# EAGLE design SparkFun_Clock_Generator_5PV49V60 (EAGLE 9.5.1)
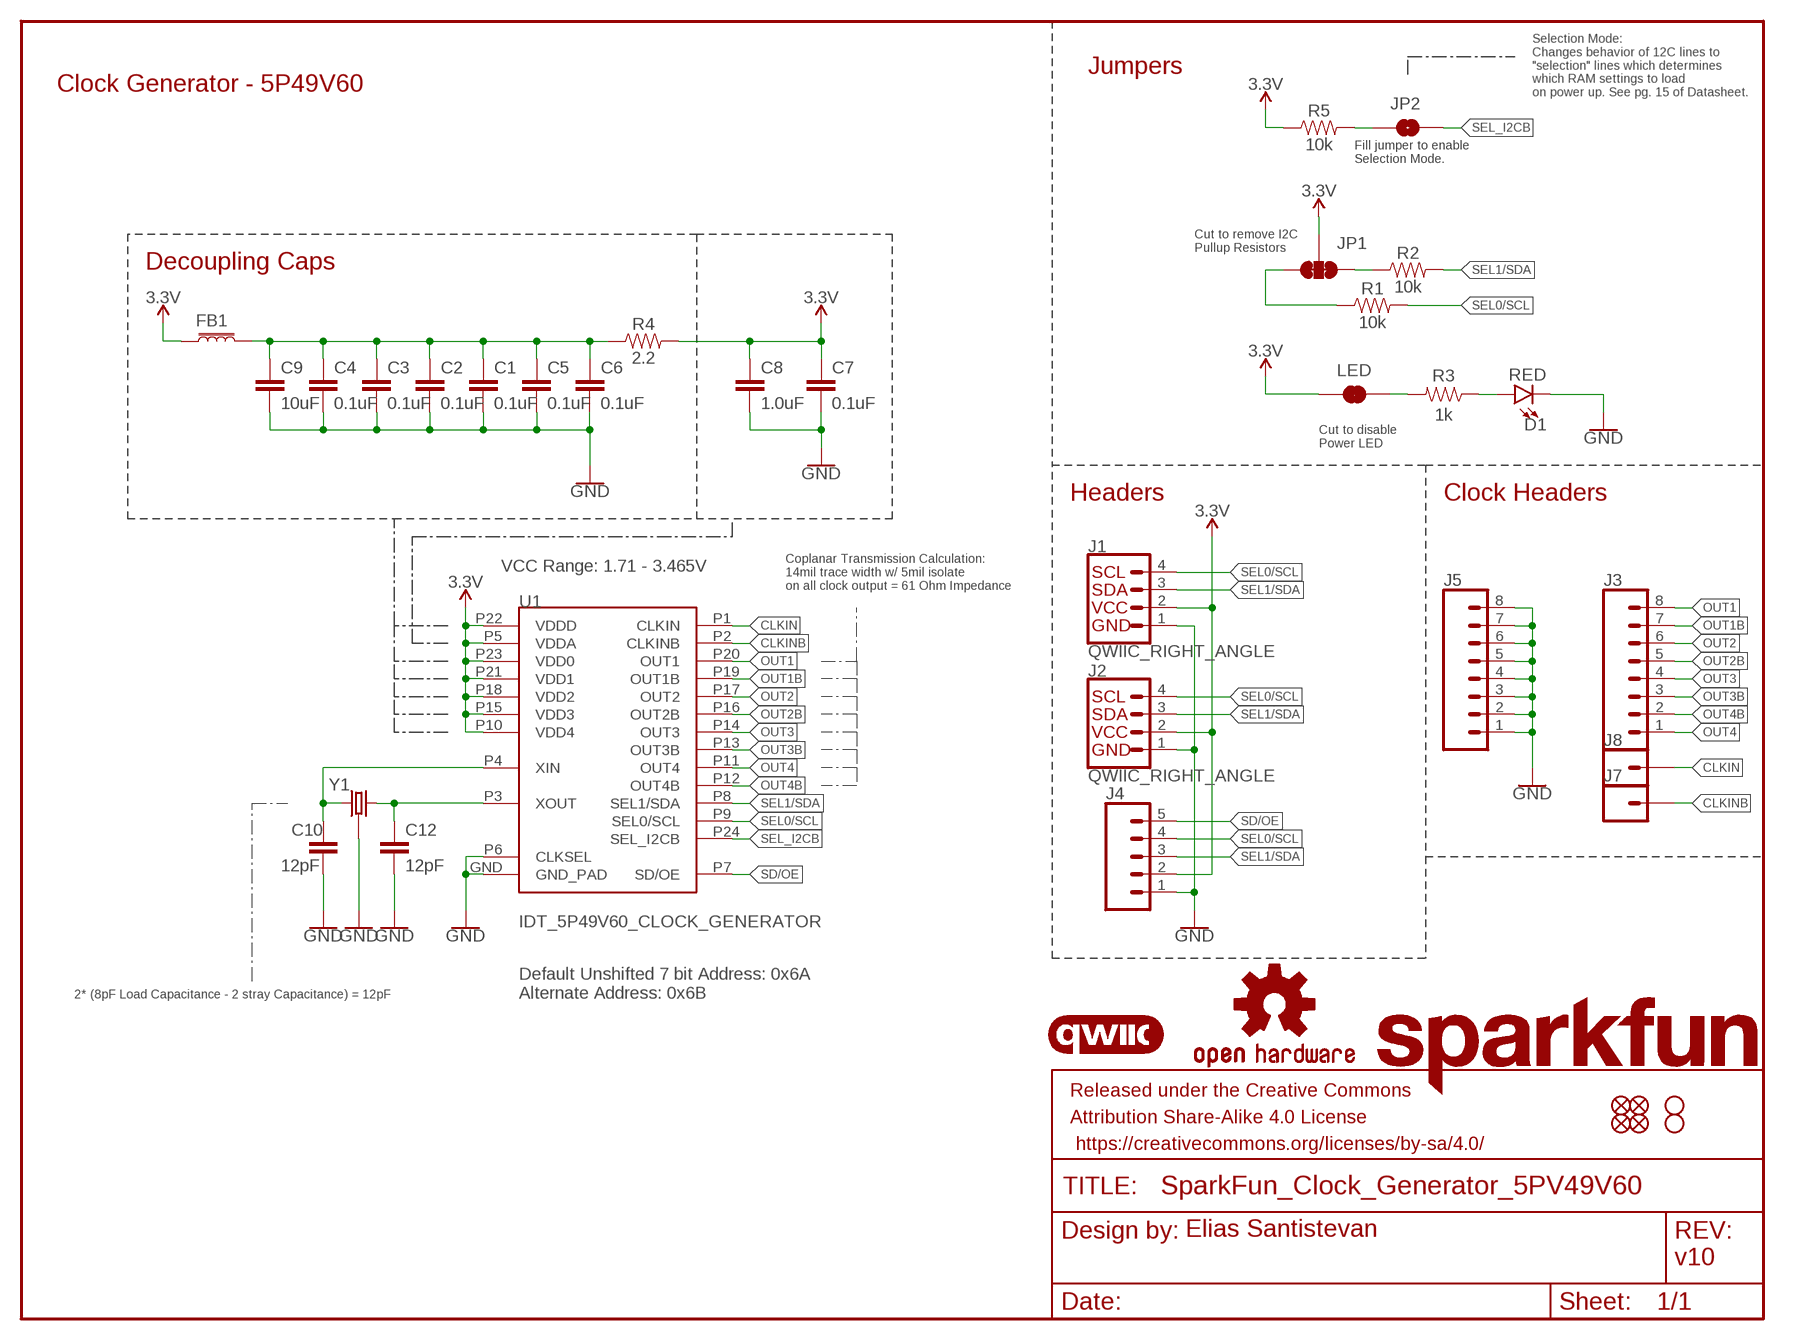
[diagram p0: schematic, sheet 1]

## Parts
C1  0.1uF  0.1UF-0402-16V-10%  [0402]
C2  0.1uF  0.1UF-0402-16V-10%  [0402]
C3  0.1uF  0.1UF-0402-16V-10%  [0402]
C4  0.1uF  0.1UF-0402-16V-10%  [0402]
C5  0.1uF  0.1UF-0402-16V-10%  [0402]
C6  0.1uF  0.1UF-0402-16V-10%  [0402]
C7  0.1uF  0.1UF-0402-16V-10%  [0402]
C8  1.0uF  1.0UF-0402-16V-10%  [0402]
C9  10uF  10UF-0603-6.3V-20%  [0603]
C10  12pF  12PF-0402-50V-5%  [0402]
C12  12pF  12PF-0402-50V-5%  [0402]
D1  RED  LED-RED0603  [LED-0603]
FB1  FERRITE_BEAD-120_OHM-0402  [0402]
FD1  FIDUCIALUFIDUCIAL  [FIDUCIAL-MICRO]
FD2  FIDUCIALUFIDUCIAL  [FIDUCIAL-MICRO]
FD3  FIDUCIALUFIDUCIAL  [FIDUCIAL-MICRO]
FD4  FIDUCIALUFIDUCIAL  [FIDUCIAL-MICRO]
FRAME1  FRAME-LETTER  [CREATIVE_COMMONS]
H1  STAND-OFFTIGHT  [STAND-OFF-TIGHT]
H2  STAND-OFFTIGHT  [STAND-OFF-TIGHT]
J1  QWIIC_RIGHT_ANGLE  QWIIC_CONNECTORJS-1MM  [JST04_1MM_RA]
J2  QWIIC_RIGHT_ANGLE  QWIIC_CONNECTORJS-1MM  [JST04_1MM_RA]
J3  CONN_08NO_SILK_FEMALE_PTH  [1X08_NO_SILK]
J4  CONN_05NO_SILK  [1X05_NO_SILK]
J5  CONN_08NO_SILK_FEMALE_PTH  [1X08_NO_SILK]
J7  CONN_01PTH_NO_SILK_SMALL  [1X01_SMALL]
J8  CONN_01PTH_NO_SILK_SMALL  [1X01_SMALL]
JP1  JUMPER-SMT_3_2-NC_TRACE_SILK  [SMT-JUMPER_3_2-NC_TRACE_SILK]
JP2  JUMPER-SMT_2_NO_SILK  [SMT-JUMPER_2_NO_SILK]
LED  JUMPER-SMT_2_NC_TRACE_SILK  [SMT-JUMPER_2_NC_TRACE_SILK]
LOGO1  SFE_LOGO_NAME.1_INCH  [SFE_LOGO_NAME_.1]
LOGO2  OSHW-LOGOS  [OSHW-LOGO-S]
LOGO3  QWIIC_LOGO_4MM  [QWIIC_4MM]
R1  10k  10KOHM-0402-1/16W-1%  [0402]
R2  10k  10KOHM-0402-1/16W-1%  [0402]
R3  1KOHM-0402-1/16W-1%  [0402]
R4  2.2  2.2OHM-0603-1/10W-5%  [0603]
R5  10k  10KOHM-0402-1/16W-1%  [0402]
U1  IDT_5P49V60_CLOCK_GENERATOR  [VFQFPN-24]
Y1  16MHz  CRYSTAL-16MHZ_SMALL  [CRYSTAL-SMD-2X2.5MM]

## Nets
3.3V: C1.1 C2.1 C3.1 C4.1 C5.1 C6.1 C7.1 C8.1 C9.1 FB1.1 FB1.2 J1.2 J2.2 J4.2 JP1.2 LED.2 R4.1 R4.2 R5.1 U1.P5(VDDA) U1.P10(VDD4) U1.P15(VDD3) U1.P18(VDD2) U1.P21(VDD1) U1.P22(VDDD) U1.P23(VDD0)
CLKIN: J8.P$1 U1.P1(CLKIN)
CLKINB: J7.P$1 U1.P2(CLKINB)
GND: C1.2 C2.2 C3.2 C4.2 C5.2 C6.2 C7.2 C8.2 C9.2 C10.2 C12.2 D1.C J1.1 J2.1 J4.1 J5.1 J5.2 J5.3 J5.4 J5.5 J5.6 J5.7 J5.8 U1.GND(GND_PAD) U1.P6(CLKSEL) Y1.P2(GND) Y1.P4(GND)
N$1: JP1.1 R2.1
N$2: C12.1 U1.P3(XOUT) Y1.P1
N$3: JP1.3 R1.1
N$4: LED.1 R3.2
N$5: D1.A R3.1
N$6: C10.1 U1.P4(XIN) Y1.P3
N$7: JP2.1 R5.2
OUT1 [Clock]: J3.8 U1.P20(OUT1)
OUT1B [Clock]: J3.7 U1.P19(OUT1B)
OUT2 [Clock]: J3.6 U1.P17(OUT2)
OUT2B [Clock]: J3.5 U1.P16(OUT2B)
OUT3 [Clock]: J3.4 U1.P14(OUT3)
OUT3B [Clock]: J3.3 U1.P13(OUT3B)
OUT4 [Clock]: J3.1 U1.P11(OUT4)
OUT4B [Clock]: J3.2 U1.P12(OUT4B)
SD/OE: J4.5 U1.P7(SD/OE)
SEL0/SCL: J1.4 J2.4 J4.4 R1.2 U1.P9(SEL0/SCL)
SEL1/SDA: J1.3 J2.3 J4.3 R2.2 U1.P8(SEL1/SDA)
SEL_I2CB: JP2.2 U1.P24(SEL_I2CB)

## Notes on the sheet
- Jumpers
- Clock Generator - 5P49V60
- Selection Mode: 
  Changes behavior of 12C lines to 
  "selection" lines which determines 
  which RAM settings to load
  on power up. See pg. 15 of Datasheet.
- Fill jumper to enable
  Selection Mode.
- Cut to remove I2C
  Pullup Resistors
- Decoupling Caps
- 1k
- Cut to disable
  Power LED
- Headers | Clock Headers
- VCC Range: 1.71 - 3.465V
- Coplanar Transmission Calculation:
  14mil trace width w/ 5mil isolate 
  on all clock output = 61 Ohm Impedance
- 2* (8pF Load Capacitance - 2 stray Capacitance) = 12pF
- Default Unshifted 7 bit Address: 0x6A
  Alternate Address: 0x6B
- Elias Santistevan
- v10

## Library data of the parts
C1-C7 = SparkFun-Capacitors:0.1UF: 0.1µF ceramic capacitors A capacitor is a passive two-terminal electrical component used to store electrical energy temporarily in an electric field.; PROD_ID: CAP-12416
C8 = SparkFun-Capacitors:1.0UF: 1µF ceramic capacitors A capacitor is a passive two-terminal electrical component used to store electrical energy temporarily in an electric field.; PROD_ID: CAP-12417
C9 = SparkFun-Capacitors:10UF: 10.0µF ceramic capacitors A capacitor is a passive two-terminal electrical component used to store electrical energy temporarily in an electric field.; PROD_ID: CAP-11015
C10 C12 = SparkFun-Capacitors:12PF: 12pF ceramic capacitors A capacitor is a passive two-terminal electrical component used to store electrical energy temporarily in an electric field.; PROD_ID: CAP-14665
D1 = SparkFun-LED:LED-RED: Red SMD LED Used in manufacturing of most products at SparkFun Packages: 0603 - SMD 0603 package [Product Link] <http://docs.avagotech.com/docs/AV02-0551EN> 0603 SMART - SMD 0603 SMART package ( more efficient and expensive)[Product Link] <http://www.osram-os.com/Graphics/XPic2/00077099_0.pdf> 1206 - SMD1206 package [Product Link] <https://www.sparkfun.com/datasheets/DevTools/LilyPad/Q150OVS4.pdff> SparkFun Products: Pro Mini 328 -5V <https://www.sparkfun.com/products/821> RedBoard <https://www.sparkfun.com/products/12757> IOIO-OTG <https://www.sparkfun.com/products/13613>; PROD_ID: DIO-00819
FB1 = SparkFun-Coils:FERRITE_BEAD-120_OHM: Ferrite Bead (blocks, cores, rings, chokes, etc.) Inductor with layers of ferrite used to suppress high frequencies. Often used to isolate high frequency noise.; MFG_PART: BLM15HB121SN1D; PROD_ID: NDUC-14206
FD1-FD4 = SparkFun-Aesthetics:FIDUCIAL: Fiducial Alignment Points Point-of-reference for pick-and-place machines and other optical instruments.
FRAME1 = SparkFun-Aesthetics:FRAME-LETTER: Schematic Frame - Letter Standard 8.5x11 US Letter frame
H1 H2 = SparkFun-Hardware:STAND-OFF: Stand Off Drill holes for mechanically mounting via screws, standoffs, etc. Note: Use the keepout ring to avoid running the screw head into surrounding components. Variant Overviews STAND-OFF - Mechanical footprint for a #4 phillips button head screw. STAND-OFF-TIGHT - Mechanical footprint for a #4 phillips button head screw, Example SparkFun Products Screw - Phillips Head (1/4", 4-40, 10 pack) <https://www.sparkfun.com/products/10453> (PRT-10453) Screw - Phillips Head (1/2", 4-40, 10 pack) <https://www.sparkfun.com/products/10452> (PRT-10452) Screw - Phillips Head (3/4", 4-40, 10 pack) <https://www.sparkfun.com/products/10451> (PRT-10451) Screw - Phillips Head (1", 4-40, 10 pack) <https://www.sparkfun.com/products/10450> (PRT-10450)
J1 J2 = SparkFun-Connectors:QWIIC_CONNECTOR: SparkFun I2C Standard Qwiic Connector An SMD 1mm pitch JST connector makes it easy and quick (get it? Qwiic?) to connect I2C devices to each other. The Qwiic system <http://www.sparkfun.com/qwiic> enables fast and solderless connection between popular platforms and various sensors and actuators. We carry 200mm <https://www.sparkfun.com/products/14204>, 100mm <https://www.sparkfun.com/products/14205>, 50mm <https://www.sparkfun.com/products/14206>, and breadboard friendly <https://www.sparkfun.com/products/14207> Qwiic cables. We also offer 10 pcs strips <https://www.sparkfun.com/products/14323> the SMD connectors.; PROD_ID: CONN-13694
J3 J5 = SparkFun-Connectors:CONN_08: Multi connection point. Often used as Generic Header-pin footprint for 0.1 inch spaced/style header connections On any of the 0.1 inch spaced packages, you can populate with these: Break Away Headers - Straight <https://www.sparkfun.com/products/116> (PRT-00116) Break Away Male Headers - Right Angle <https://www.sparkfun.com/products/553> (PRT-00553) Female Headers <https://www.sparkfun.com/products/115> (PRT-00115) Break Away Headers - Machine Pin <https://www.sparkfun.com/products/117> (PRT-00117) Break Away Female Headers - Swiss Machine Pin <https://www.sparkfun.com/products/743> (PRT-00743) Arduino Stackable Header - 8 Pin <https://www.sparkfun.com/products/9279> (PRT-09279) For SCREWTERMINALS and SPRING TERMINALS visit here: Screw Terimnals on SparkFun.com <https://www.sparkfun.com/search/results?term=Screw+Terminals> (5mm/3.5mm/2.54mm spacing) This device is also useful as a general connection point to wire up your design to another part of your project. Our various solder wires solder well into these plated through hole pads. Hook-Up Wire - Assortment (Stranded, 22 AWG) <https://www.sparkfun.com/products/11375> (PRT-11375) Hook-Up Wire - Assortment (Solid Core, 22 AWG) <https://www.sparkfun.com/products/11367> (PRT-11367) View the entire wire category on our website here <https://www.sparkfun.com/categories/141> Special notes: Molex polarized connector foot print use with SKU : PRT-08231 with associated crimp pins and housings. 1MM SMD Version SKU: PRT-10208 NOTES ON THE VARIANTS LOCK and LOCK_LONGPADS... This footprint was designed to help hold the alignment of a through-hole component (i.e. 6-pin header) while soldering it into place. You may notice that each hole has been shifted either up or down by 0.005 of an inch from it's more standard position (which is a perfectly straight line). This slight alteration caused the pins (the squares in the middle) to touch the edges of the holes. Because they are alternating, it causes a "brace" to hold the component in place. 0.005 has proven to be the perfect amount of "off-center" position when using our standard breakaway headers. Although looks a little odd when you look at the bare footprint, once you have a header in there, the alteration is very hard to notice. Also,if you push a header all the way into place, it is covered up entirely on the bottom side.; PROD_ID: CONN-08438
J4 = SparkFun-Connectors:CONN_05: Multi connection point. Often used as Generic Header-pin footprint for 0.1 inch spaced/style header connections On any of the 0.1 inch spaced packages, you can populate with these: Break Away Headers - Straight <https://www.sparkfun.com/products/116> (PRT-00116) Break Away Male Headers - Right Angle <https://www.sparkfun.com/products/553> (PRT-00553) Female Headers <https://www.sparkfun.com/products/115> (PRT-00115) Break Away Headers - Machine Pin <https://www.sparkfun.com/products/117> (PRT-00117) Break Away Female Headers - Swiss Machine Pin <https://www.sparkfun.com/products/743> (PRT-00743) For SCREWTERMINALS and SPRING TERMINALS visit here: Screw Terimnals on SparkFun.com <https://www.sparkfun.com/search/results?term=Screw+Terminals> (5mm/3.5mm/2.54mm spacing) This device is also useful as a general connection point to wire up your design to another part of your project. Our various solder wires solder well into these plated through hole pads. Hook-Up Wire - Assortment (Stranded, 22 AWG) <https://www.sparkfun.com/products/11375> (PRT-11375) Hook-Up Wire - Assortment (Solid Core, 22 AWG) <https://www.sparkfun.com/products/11367> (PRT-11367) View the entire wire category on our website here <https://www.sparkfun.com/categories/141> Special notes: Molex polarized connector foot print use with SKU : PRT-08231 with associated crimp pins and housings. 1MM SMD Version SKU: PRT-10208
J7 J8 = SparkFun-Connectors:CONN_01: Single connection point. Often used as Generic Header-pin footprint for 0.1 inch spaced/style header connections On any of the 0.1 inch spaced packages, you can populate with these: Break Away Headers - Straight <https://www.sparkfun.com/products/116> (PRT-00116) Break Away Male Headers - Right Angle <https://www.sparkfun.com/products/553> (PRT-00553) Female Headers <https://www.sparkfun.com/products/115> (PRT-00115) Break Away Headers - Machine Pin <https://www.sparkfun.com/products/117> (PRT-00117) Break Away Female Headers - Swiss Machine Pin <https://www.sparkfun.com/products/743> (PRT-00743) This device is also useful as a general connection point to wire up your design to another part of your project. Our various solder wires solder well into these plated through hole pads. Hook-Up Wire - Assortment (Stranded, 22 AWG) <https://www.sparkfun.com/products/11375> (PRT-11375) Hook-Up Wire - Assortment (Solid Core, 22 AWG) <https://www.sparkfun.com/products/11367> (PRT-11367) View the entire wire category on our website here <https://www.sparkfun.com/categories/141> Special notes: SMTSO-256-ET is a "flush mount" nut for a 4-40 screw. We mostly use this on specialty testbeds; it is a nice way to connect hardware to your PCB at an adjustable hieght. Also note, the SNAP packages are for using a snappable style connector. We sell a baggie of snaps and they are also used on two LilyPad designs: Snap Assortment - 30 pack (male and female) <https://www.sparkfun.com/products/11347> (DEV-11347) LilyPad Arduino SimpleSnap <https://www.sparkfun.com/products/10941> (DEV-10941) LilyPad SimpleSnap Protoboard <https://www.sparkfun.com/products/10940> (DEV-10940)
JP1 = SparkFun-Jumpers:JUMPER-SMT_3_2-NC_TRACE: Normally closed trace jumper (2 of 2 connections) This jumper has a trace between all three pads so they are normally closed (NC). Use a razor knife to open the connection(s). For best results follow the IPC guidelines for cutting traces: Cutout at least 0.063 mm (0.005 in). Remove all loose material to clean up the cut area. Seal the cut with an approved epoxy. Reapply solder to reclose the connection(s).
JP2 = SparkFun-Jumpers:JUMPER-SMT_2_NO: Normally open jumper This jumper has two pads in close proximity to each other. Apply solder to close the connection. Round pads are easier to solder for beginners, but are a lot larger. SparkFun Product that uses the round pads: SparkFun EL Sequencer <https://www.sparkfun.com/products/12781>
LED = SparkFun-Jumpers:JUMPER-SMT_2_NC_TRACE: Normally closed trace jumper This jumper has a trace between two pads so it's normally closed (NC). Use a razor knife to open the connection. For best results follow the IPC guidelines for cutting traces: Cutout at least 0.063 mm (0.005 in). Remove all loose material to clean up the cut area. Seal the cut with an approved epoxy. Reapply solder to reclose the connection.
LOGO1 = SparkFun-Aesthetics:SFE_LOGO_NAME: SparkFun Font Logo This is the SparkFun name logo. The logo on the schematic will always be the same size; the package variant is the height of the flame part of the logo (or the height the flame would be, if it were drawn). Default layer for the logo on the board is tSilk.
LOGO2 = SparkFun-Aesthetics:OSHW-LOGO: Open-Source Hardware (OSHW) Logo This logo indicates the piece of hardware it is found on incorporates a OSHW license and/or adheres to the definition of open source hardware found here: http://freedomdefined.org/OSHW
LOGO3 = SparkFun-Aesthetics:QWIIC_LOGO: Qwiic Logos for placement on schematic and PCB. The 5.5mm silk logo is best for placing next to Qwiic connector.
R1 R2 R5 = SparkFun-Resistors:10KOHM: 10kΩ resistor A resistor is a passive two-terminal electrical component that implements electrical resistance as a circuit element. Resistors act to reduce current flow, and, at the same time, act to lower voltage levels within circuits. - Wikipedia; PROD_ID: RES-14241
R3 = SparkFun-Resistors:1KOHM: 1kΩ resistor A resistor is a passive two-terminal electrical component that implements electrical resistance as a circuit element. Resistors act to reduce current flow, and, at the same time, act to lower voltage levels within circuits. - Wikipedia; PROD_ID: RES-14342
R4 = SparkFun-Resistors:2.2OHM: 2.2Ω resistor A resistor is a passive two-terminal electrical component that implements electrical resistance as a circuit element. Resistors act to reduce current flow, and, at the same time, act to lower voltage levels within circuits. - Wikipedia; PROD_ID: RES-07823
U1 = SparkFun-IC-Special-Function:IDT_5P49V60_CLOCK_GENERATOR: Clock Generator 5P49V60 The 5P49V60 is a programmable clock generator intended for automotive applications. Configurations may be stored in on-chip One-Time Programmable (OTP) memory or changed using I2C interface. This is IDT’s sixth generation of programmable clock technology (VersaClock 6E). The frequencies are generated from a single reference clock. The reference clock can come from one of the two redundant clock inputs. A glitchless manual switchover function allows one of the redundant clocks to be selected during normal operation. Two select pins allow up to four different configurations to be programmed and accessible using processor GPIOs or bootstrapping. The different selections may be used for different operating modes (full function, partial function, partial power-down), regional standards (US, Japan, Europe) or system production margin testing. The device may be configured to use one of two I2C addresses to allow multiple devices to be used in a system.; PROD_ID: IC-14612
Y1 = SparkFun-Clocks:CRYSTAL-16MHZ_SMALL: 16 MHz Crystal Digikey Link <https://www.digikey.com/product-detail/en/epson/FA-20H-16.0000MF10Z-AJ5/SER4201TR-ND/7430936> Crystal Attributes: Frequency: 16 MHz Frequency Stability: +/- 10ppm Frequency Tolerance: +/- 10ppm Load Capacitance: 8pF ESR: 80 Ohms Operating Mode: Fundamental PAD 2 and PAD 4 are GROUNDED; PROD_ID: XTAL-14664

## Net classes
1 Clock: clearance 0.127 mm

## Board
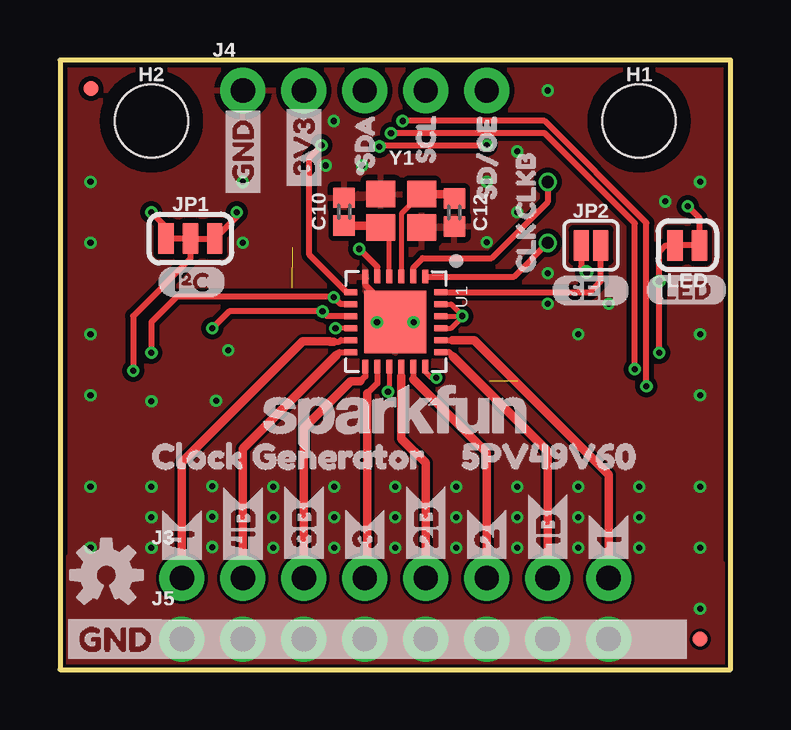
[diagram p1: board, top side]
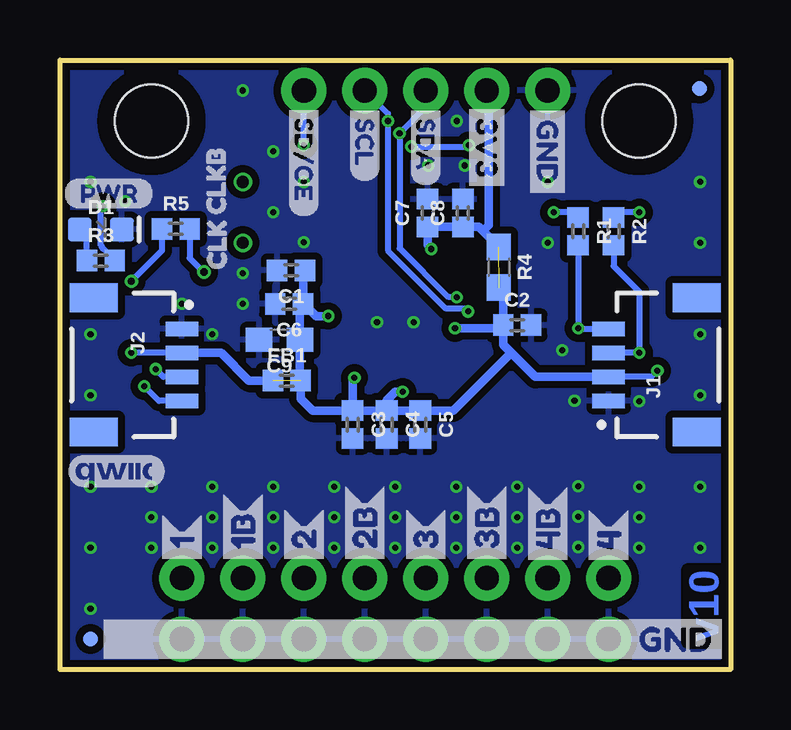
[diagram p2: board, bottom side, seen from below]

Size 27.94 x 25.4 mm. Coordinates in mm from the lower left corner, seen from the top.
Outline: 0,25.4 0,0 27.94,0 27.94,25.4 0,25.4
Copper layers (1*16): Top 0.035mm / dielectric 1.5mm / Bottom 0.035mm
Design rules "SparkFun-2-layer-FAB-LIMIT": minimum track width 4mil, minimum drill 6mil, track to track 4mil, track to pad 4mil, pad to pad 4mil, via to via 4mil, smd to smd 4mil, copper to edge 4mil, drill to drill 4mil, minimum pad ring 5mil, minimum via ring 5mil, stop-mask expansion 4mil, vias tented up to drill 25mil, thermal gap 10mil
tRestrict: area 15.4,14.4 to 15.5,15.3; area 13.6,15.8 to 14.6,16; area 12.5,14.4 to 12.6,15.4

### Footprints (pad centres in the part's own frame; a part is rotated, then mirrored left to right if it is on the bottom)
0402 = smd 0.85 x 0.9: 1 -0.58,0; 2 0.58,0
0603 = smd 1.1 x 1: 1 -0.85,0; 2 0.85,0
LED-0603 = smd 1 x 1: A -0.877,0; C 0.877,0
FIDUCIAL-MICRO = smd 0.635 x 0.635: 1 0,0
STAND-OFF-TIGHT = hole 3.048: 0,0
JST04_1MM_RA = smd 0.6 x 1.35: 1 -1.5,0; 2 -0.5,0; 3 0.5,0; 4 1.5,0 | smd 1.2 x 2: NC1 2.8,-3.675; NC2 -2.8,-3.675
1X08_NO_SILK = drill 1.016 pad 1.88: 1 0,0; 2 2.54,0; 3 5.08,0; 4 7.62,0; 5 10.16,0; 6 12.7,0; 7 15.24,0; 8 17.78,0
1X05_NO_SILK = drill 1.016 pad 1.88: 1 0,0; 2 2.54,0; 3 5.08,0; 4 7.62,0; 5 10.16,0
1X01_SMALL = drill 0.508: P$1 0,0
SMT-JUMPER_3_2-NC_TRACE_SILK = smd 0.635 x 1.27: 1 -1.016,0; 2 0,0; 3 1.016,0
SMT-JUMPER_2_NO_SILK = smd 0.635 x 1.27: 1 -0.406,0; 2 0.406,0
SMT-JUMPER_2_NC_TRACE_SILK = smd 0.635 x 1.27: 1 -0.508,0; 2 0.508,0
VFQFPN-24 = smd 2.6 x 2.6: GND 0,0 | smd 0.55 x 0.25: P1 -1.9,1.25; P2 -1.9,0.75; P3 -1.9,0.25; P4 -1.9,-0.25; P5 -1.9,-0.75; P6 -1.9,-1.25; P13 1.85,-1.25; P14 1.85,-0.75; P15 1.85,-0.25; P16 1.85,0.25; P17 1.85,0.75; P18 1.85,1.25 | smd 0.25 x 0.55: P7 -1.25,-1.85; P8 -0.75,-1.85; P9 -0.25,-1.85; P10 0.25,-1.85; P11 0.75,-1.85; P12 1.25,-1.85; P19 1.25,1.9; P20 0.75,1.9; P21 0.25,1.9; P22 -0.25,1.9; P23 -0.75,1.9; P24 -1.25,1.9
CRYSTAL-SMD-2X2.5MM = smd 1.2 x 1.1: P1 0.846,0.69; P2 -0.854,0.69; P3 -0.854,-0.71; P4 0.846,-0.71

### Placement (x,y rotation side)
C1  18.31,16.64 180 bottom
C2  8.89,14.35 0 bottom
C3  15.75,10.21 270 bottom
C4  14.33,10.21 270 bottom
C5  12.93,10.21 270 bottom
C6  18.39,15.24 180 bottom
C7  12.62,19.02 90 bottom
C8  11.15,19.02 90 bottom
C9  18.8,13.74 180 bottom
C10  11.84,19.08 90 top
C12  16.43,19.05 270 top
D1  26.24,18.34 0 bottom
FB1  18.49,12.04 0 bottom
FD1  1.3,24.21 0 top
FD2  1.3,24.21 0 bottom
FD3  26.67,1.27 0 bottom
FD4  26.67,1.27 0 top
FRAME1  -8.38,-14.73 0 top  (outside the outline)
H1  24.13,22.86 0 top
H2  3.81,22.86 0 top
J1  5.08,12.7 90 bottom
J2  22.86,12.7 270 bottom
J3  5.08,3.81 0 top
J4  7.62,24.13 0 top
J5  5.08,1.27 0 top
J7  20.32,20.32 0 top
J8  20.32,17.78 0 top
JP1  5.44,17.96 0 top
JP2  22.12,17.68 0 top
LED  26.14,17.68 180 top
LOGO1  13.97,10.44 0 top
LOGO2  1.93,3.94 0 top
LOGO3  25.58,8.26 0 bottom
R1  6.35,18.26 270 bottom
R2  4.88,18.26 270 bottom
R3  26.24,17.04 0 bottom
R4  9.65,16.76 270 bottom
R5  23.11,18.36 0 bottom
U1  13.97,14.48 270 top
U$1  [SEL0]  20.45,15.8 0 top
U$2  [3V3-03]  10.16,19.71 90 top
U$3  [GND-03]  7.62,19.46 90 top
U$4  [PWR-()-03]  27.79,19.84 0 bottom
U$5  [SDA11]  12.7,20.22 90 top
U$6  [SCL10]  15.24,20.42 90 top
U$7  [SD#OE12]  17.78,18.9 90 top
U$8  [46]  5.08,4.06 90 bottom
U$9  [4B7]  7.62,4.09 90 bottom
U$10  [3B5]  10.16,4.09 90 bottom
U$11  [34]  12.7,4.09 90 bottom
U$12  [2B3]  15.24,4.09 90 bottom
U$13  [22]  17.78,4.09 90 bottom
U$14  [1B1]  20.32,4.09 90 bottom
U$15  [10]  22.86,4.14 90 bottom
U$16  [CLOCK_GENERATOR0]  2.92,8.89 0 top
U$17  [5PV49V601]  15.82,8.89 0 top
U$18  [3V3-03]  10.16,23.8 270 bottom
U$19  [GND-03]  7.62,23.7 270 bottom
U$20  [GND-04]  4.72,1.27 0 bottom
U$21  [GND-04]  -0.13,1.27 0 top
U$22  [1B1]  20.32,4.09 90 top
U$23  [2B3]  15.24,4.09 90 top
U$24  [3B5]  10.16,4.09 90 top
U$25  [4B7]  7.62,4.09 90 top
U$26  [10]  22.86,4.14 90 top
U$27  [22]  17.78,4.09 90 top
U$28  [SCL1]  15.24,23.65 270 bottom
U$29  [SD#OE2]  17.78,23.67 270 bottom
U$30  [SDA0]  12.7,23.65 270 bottom
U$31  [CLK12]  21.41,16 90 bottom
U$32  [CLKB13]  21.44,18.29 90 bottom
U$33  [CLK12]  19.41,15.88 90 top
U$34  [CLKB13]  19.41,18.08 90 top
U$35  [I_SUPER2_C-()-03]  4.06,16.15 0 top
U$36  [LED0]  24.38,15.82 0 top
U$37  [34]  12.7,4.09 90 top
U$38  [46]  5.08,4.06 90 top
Y1  14.22,19.13 0 top

### Tracks (layer width: path | path; a pad name or v marks a point on that pad's centre or on a via)
3.3V  (via drill 0.25, 0.3)  (2 unrouted)
  Top 0.203: U1.P18 15.22,12.41 15.47,12.17 v15.67,12.17 | U1.P22 v16.76,14.73 | U1.P21 16.31,14.23 16.76,14.68 v16.76,14.73 | U1.P23 16.29,15.23 16.76,14.76 v16.76,14.73 | v13.66,11.58 13.72,11.64 U1.P15 | U1.P10 v11.48,14.22
  Top 0.254: v24.97,13.21 v24.97,16.18 24.97,17.4 25.25,17.68 LED.2 | JP1.2 5.44,17.12 3.05,14.73 v3.05,12.45 | U1.P5 13.22,16.78 v12.47,17.53
  Bottom 0.254: J2.2 v24.97,13.21 | v3.05,12.45 3.29,12.2 J1.2 | R5.1 23.69,17.45 v24.97,16.18
  Bottom 0.356: C1.1 17.92,16.45 17.81,16.33 C6.1 | C6.1 17.78,15.24 17.27,14.73 v16.76,14.73 | v15.67,12.17 15.75,12.09 C3.1 | C6.1 17.95,15.1 C9.1 | C4.1 C3.1 | C3.1 17.42,10.79 17.91,11.29 FB1.2 17.95,12.07 C9.1 | C9.1 17.88,13.68 | J2.2 21.23,13.2 20.07,12.04 FB1.1 | J1.2 8.14,12.2 9.14,13.21 | 9.14,13.21 11.56,10.79 C5.1 C4.1 | 10.32,18.28 R4.1 9.67,17.59 | 10.32,18.28 10.48,18.45 C8.1 C7.1 12.62,17.68 v12.47,17.53 | 10.32,18.28 10.08,18.52 10.08,24.05 J4.2 | R4.2 9.67,15.89 9.47,15.69 C2.1 | C4.1 14.33,11.22 13.97,11.58 v13.66,11.58 | 9.14,13.21 9.47,13.53 C2.1 | C2.1 9.6,14.22 v11.48,14.22
CLKIN
  Top 0.254: U1.P1 18.92,16.38 J8.P$1
CLKINB
  Top 0.254: U1.P2 14.72,16.75 15.11,17.14 17.98,17.14 20.32,19.48 J7.P$1
GND  (via drill 0.25)
  Top 0.254: U1.P6 12.72,16.03 13.97,14.78 U1.GND
  other vias: 14.73,14.48 13.21,14.48 6.35,7.65 8.89,7.62 11.43,7.62 16.51,7.62 19.05,7.62 21.59,7.62 13.97,7.62 11.07,21.01 17.78,17.81 7.01,13.31 3.81,11.18 21.59,13.97 20.32,16.51 20.32,15.24 12.6,21.01 3.81,7.62 3.81,6.35 24.13,7.62 24.13,6.35 6.35,6.38 8.89,6.35 11.43,6.35 16.51,6.35 19.05,6.35 21.59,6.35 13.97,6.35 1.27,7.62 26.67,7.62 17.78,20.32 3.81,5.08 6.35,5.11 8.89,5.08 11.43,5.08 13.97,5.08 16.51,5.08 19.05,5.08 21.59,5.08 24.13,5.08 26.67,5.08 1.27,5.08 26.67,2.54 26.67,20.32 1.27,17.78 1.27,20.32 11.4,22.86 19.05,19.05 19.05,21.59 22.86,15.24 25.22,19.51 1.27,11.43 1.27,13.97 26.67,13.97 26.67,11.43 7.62,17.78 7.62,20.32 6.5,11.2 20.32,24.13
  pour Top (isolate 0.203, rank 2): 0,25.4 27.94,25.4 27.94,0 0,0
  pour Bottom (isolate 0.305, rank 2): 0,25.4 27.94,25.4 27.94,0 0,0
  pour Top (isolate 0.127, no thermals): 0,0 0,4.32 9.96,14.27 12.45,14.27 12.45,12.95 15.49,12.95 15.49,14.17 17.83,14.17 27.94,4.06 27.94,0
N$1  (via drill 0.25)
  Top 0.254: JP1.1 4.42,18.44 v3.81,19.05
  Bottom 0.254: v3.81,19.05 4.67,19.05 R2.1
N$2
  Top 0.203: Y1.P1 15.03,19.82 14.22,19 U1.P3
  Top 0.356: Y1.P1 16.24,19.82 C12.1
N$3  (via drill 0.25)
  Top 0.254: JP1.3 7.37,18.87 v7.37,19.05
  Bottom 0.254: v7.37,19.05 7.34,19.07 6.58,19.07 R1.1
N$4  (via drill 0.25)
  Top 0.254: v26.16,19.3 26.64,18.82 LED.1
  Bottom 0.254: R3.2 26.16,17.55 26.16,17.59 26.24,17.66 26.24,19.23 v26.16,19.3
N$5
  Bottom 0.254: R3.1 26.82,18.04 D1.A
N$6
  Top 0.203: U1.P4 13.72,18.07 Y1.P3
  Top 0.356: C10.1 13.29,18.5 Y1.P3
N$7  (via drill 0.3)
  Top 0.254: JP2.1 21.72,16.79 v21.95,16.56
  Bottom 0.254: R5.2 22.53,17.15 v21.95,16.56
OUT1
  Top 0.254: U1.P20 16.35,13.73
  Top 0.356: 16.35,13.73 17.26,13.73 18.92,12.06 22.86,8.13 J3.8
OUT1B
  Top 0.254: U1.P19 16.21,13.23 16.36,13.08 16.36,13.06
  Top 0.356: J3.7 20.32,9.09 16.36,13.06
OUT2
  Top 0.254: U1.P17 14.72,12.1
  Top 0.356: J3.6 17.78,9.04 14.72,12.1
OUT2B
  Top 0.254: U1.P16 14.22,12.22
  Top 0.356: 14.22,12.22 14.22,9.63 15.24,8.61 J3.5
OUT3
  Top 0.254: U1.P14 13.22,11.93 12.8,11.51
  Top 0.356: 12.8,11.51 12.8,3.91 J3.4
OUT3B
  Top 0.254: U1.P13 12.72,12.22 12.51,12.01
  Top 0.356: J3.3 10.16,10.06 12.12,12.01 12.51,12.01
OUT4
  Top 0.254: 11.4,13.66 11.64,13.66 11.7,13.73 U1.P11
  Top 0.356: J3.1 5.08,8.64 10.12,13.68 11.24,13.68 11.25,13.66 11.4,13.66
OUT4B
  Top 0.254: 11.54,13.13 11.64,13.23 U1.P12
  Top 0.356: J3.2 7.62,9.21 11.54,13.13
SD/OE  (via drill 0.25)
  Top 0.254: U1.P7 11.94,15.73 10.39,17.28 10.39,21.34 v10.9,21.84 | v13.31,21.79 13.34,21.82 17.75,21.82 v17.78,21.84
  Bottom 0.254: v17.78,21.84 J4.5 | v13.31,21.79 10.95,21.79 v10.9,21.84
SEL0/SCL  (via drill 0.25)
  Top 0.254: U1.P9 11.13,14.73 v10.94,14.92 7.05,14.92 v6.35,14.22 | v24.43,11.81 24.43,18.62 20.19,22.86 v14.28,22.86
  Bottom 0.254: J1.4 6.33,14.2 v6.35,14.22 R1.2 | v10.94,14.92 11.05,15.04 11.86,15.04 14.28,17.45 v14.28,22.86 14.28,23.16 J4.4 | J2.4 23.82,11.2 v24.43,11.81
SEL1/SDA  (via drill 0.25)
  Top 0.254: v3.81,13.21 3.81,14.48 4.87,15.53 11.39,15.53 v11.4,15.52 11.7,15.23 U1.P8 | v23.95,12.52 23.95,18.59 20.19,22.35 v13.79,22.35
  Bottom 0.254: J1.3 v3.81,13.21 3.81,15.75 4.88,16.82 R2.2 | v11.4,15.52 11.76,15.52 13.79,17.55 v13.79,22.35 12.7,23.44 J4.3 | J2.3 23.63,12.2 v23.95,12.52
SEL_I2CB
  Top 0.254: U1.P24 22.08,15.73 22.53,16.18 JP2.2

### Text on the board
Bottom: v10
Measures: Units in Inches
tDocu: Elias Santistevan